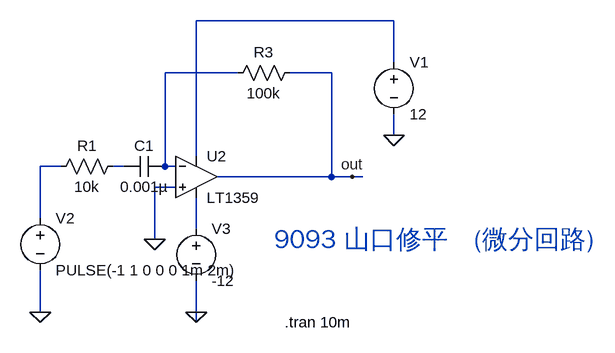
[diagram p0: schematic Draft8.asc]
Draft8.asc, the LTspice schematic file:
Version 4
SHEET 1 1172 680
WIRE 688 96 384 96
WIRE 688 160 688 96
WIRE 448 176 336 176
WIRE 592 176 528 176
WIRE 688 272 688 240
WIRE 384 304 384 96
WIRE 176 320 144 320
WIRE 272 320 256 320
WIRE 336 320 336 176
WIRE 352 320 336 320
WIRE 592 336 592 176
WIRE 592 336 416 336
WIRE 624 336 592 336
WIRE 640 336 624 336
WIRE 352 352 320 352
WIRE 144 400 144 320
WIRE 384 416 384 368
WIRE 320 432 320 352
WIRE 144 544 144 480
WIRE 384 544 384 496
WIRE 384 560 384 544
FLAG 144 544 0
FLAG 688 272 0
FLAG 624 336 out
FLAG 320 432 0
FLAG 384 544 0
SYMBOL voltage 688 144 R0
SYMATTR InstName V1
SYMATTR Value 12
SYMBOL voltage 144 384 R0
SYMATTR InstName V2
SYMATTR Value PULSE(-1 1 0 0 0 1m 2m)
SYMBOL res 544 160 R90
WINDOW 0 0 56 VBottom 2
WINDOW 3 32 56 VTop 2
SYMATTR InstName R3
SYMATTR Value 100k
SYMBOL res 272 304 R90
WINDOW 0 0 56 VBottom 2
WINDOW 3 32 56 VTop 2
SYMATTR InstName R1
SYMATTR Value 10k
SYMBOL cap 336 304 R90
WINDOW 0 0 32 VBottom 2
WINDOW 3 32 32 VTop 2
SYMATTR InstName C1
SYMATTR Value 0.001µ
SYMBOL voltage 384 400 R0
SYMATTR InstName V3
SYMATTR Value -12
SYMBOL LT1359 384 272 R0
SYMATTR InstName U2
TEXT 520 560 Left 2 !.tran 10m
TEXT 504 432 Left 4 ;9093 山口修平　(微分回路)

The netlist it stands for:
* Draft8.asc
V1 N001 0 12
V2 N003 0 PULSE(-1 1 0 0 0 1m 2m)
R3 out N002 100k
R1 N004 N003 10k
C1 N002 N004 0.001µ
V3 N005 0 -12
* U2: LT1359 (symbol LT1359 not available, pins judged from their places): In+=0 In-=N002 V+=N001 V-=N005 OUT=out
.tran 10m
* 9093 山口修平　(微分回路)
.backanno
.end